# Altium schematic sheet USB.SchDoc
size A; SheetNumber: 2; SheetTotal: 15
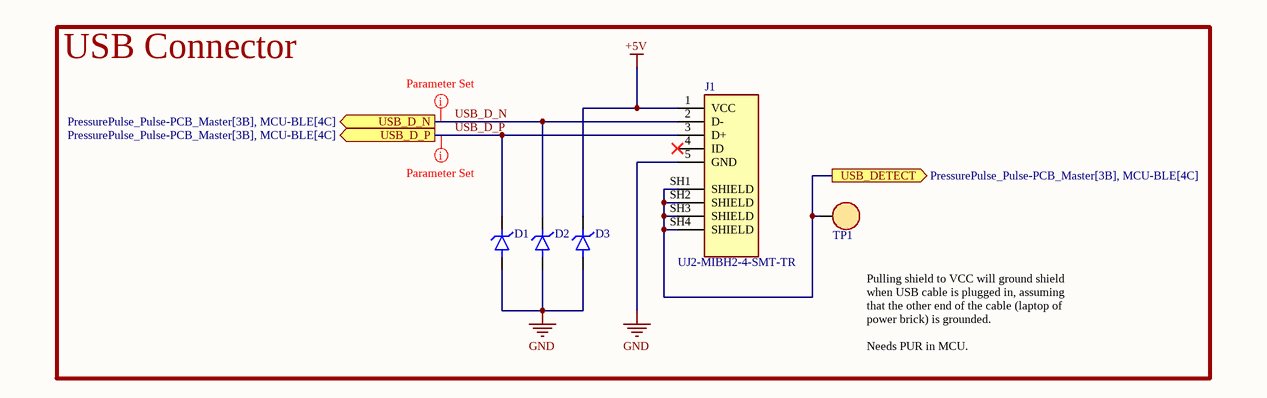
[diagram p0: USB.SchDoc]

## Parts
D1  RCLAMP0521P.TCT  [BDFN2C051V40]  (value not drawn)
D2  RCLAMP0521P.TCT  [BDFN2C051V40]  (value not drawn)
D3  RCLAMP0521P.TCT  [BDFN2C051V40]  (value not drawn)
J1  UJ2-MIBH2-4-SMT-TR  [USB MICRO JLC]
TP1  RH-5019  [TP - RH-5019]  (value not drawn)

## Blocks framed on the sheet
USB Connector: D1-D3 J1 TP1

## Ports
USB_D_N (out, see PressurePulse_Pulse-PCB_Master[3B], MCU-BLE[4C]), USB_D_P (out, see PressurePulse_Pulse-PCB_Master[3B], MCU-BLE[4C]), USB_DETECT (out, see PressurePulse_Pulse-PCB_Master[3B], MCU-BLE[4C])

## Nets
+5V: D3.K J1.1(VCC)
GND: D1.A D2.A D3.A J1.5(GND)
USB_D_N: D2.K J1.2(D-) ; port USB_D_N
USB_D_P: D1.K J1.3(D+) ; port USB_D_P
USB_DETECT: J1.SH1(SHIELD) J1.SH2(SHIELD) J1.SH3(SHIELD) J1.SH4(SHIELD) TP1.1 ; port USB_DETECT

Not connected (* = marked no-connect by the designer): J1 4(ID)*

## Layout directives
net class USB: USB_D_N, USB_D_P

## Notes on the sheet
- Pulling shield to VCC will ground shield when USB cable is plugged in, assuming that the other end of the cable (laptop of power brick) is grounded.
  Needs PUR in MCU.

## Library data of the parts
D1-D3 = TVS DIODE: 25V Clamp 4A (8/20µs) Ipp Tvs Diode Surface Mount SLP1006P2; MFR: BORN; Type: SMD; Value: BDFN2C051V40; MFR PN: BDFN2C051V40; JLCPCB PN: C152023
J1 = Micro USB Port: Micro B, USB 2.0, 1.8 A, Right Angle, Surface Mount (SMT), USB Receptacle; MFR: CUI Devices; Value: UA0507065250-037-06; JLCPCB PN: C5249562
TP1 = TEST POINT: MFR: ronghe; MFR PN: RH-5019; Value: RH-5019; JLCPCB PN: C5199800